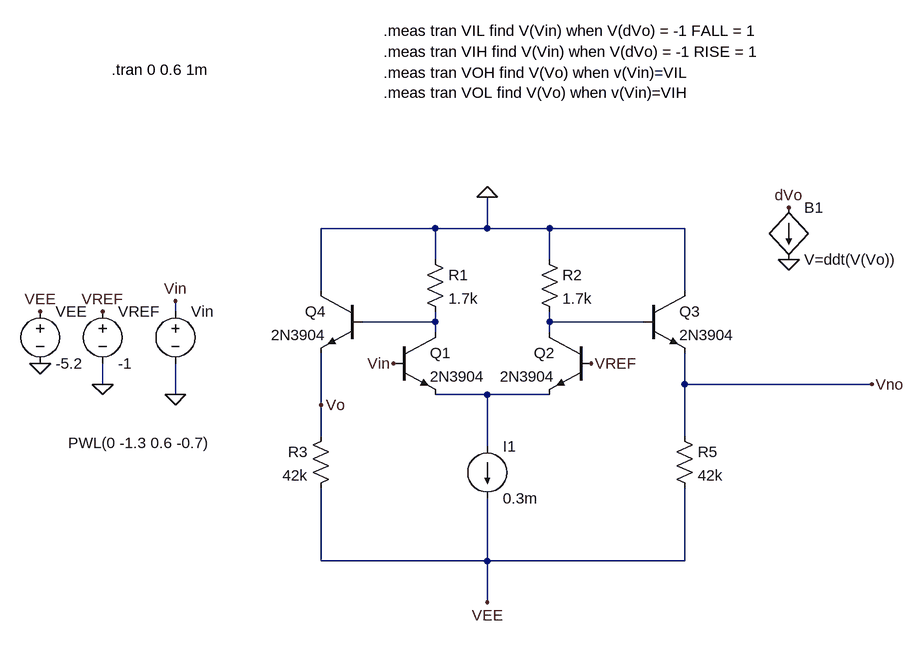
[diagram p0: schematic ECL_inverter_measure.asc]
ECL_inverter_measure.asc, the LTspice schematic file:
Version 4
SHEET 1 1408 680
WIRE 352 -160 176 -160
WIRE 432 -160 432 -208
WIRE 432 -160 352 -160
WIRE 528 -160 432 -160
WIRE 736 -160 528 -160
WIRE 352 -112 352 -160
WIRE 528 -112 528 -160
WIRE 176 -64 176 -160
WIRE 736 -64 736 -160
WIRE -48 -32 -48 -48
WIRE 352 -16 352 -32
WIRE 352 -16 240 -16
WIRE 528 -16 528 -32
WIRE 672 -16 528 -16
WIRE 352 0 352 -16
WIRE 528 0 528 -16
WIRE -160 80 -160 48
WIRE 736 80 736 32
WIRE 1024 80 736 80
WIRE -48 96 -48 48
WIRE 432 96 352 96
WIRE 528 96 432 96
WIRE 176 112 176 32
WIRE 176 160 176 112
WIRE 736 160 736 80
WIRE 432 176 432 96
WIRE 176 352 176 240
WIRE 432 352 432 256
WIRE 432 352 176 352
WIRE 736 352 736 240
WIRE 736 352 432 352
WIRE 432 416 432 352
FLAG -48 96 0
FLAG -160 80 0
FLAG -160 -32 VREF
FLAG 1024 80 Vno
FLAG 896 -112 0
FLAG 896 -192 dVo
FLAG -48 -48 Vin
FLAG 288 48 Vin
FLAG -256 -32 VEE
FLAG -256 48 0
FLAG 592 48 VREF
FLAG 432 -208 0
FLAG 432 416 VEE
FLAG 176 112 Vo
SYMBOL voltage -48 -48 R0
WINDOW 123 0 0 Left 0
WINDOW 39 0 0 Left 0
WINDOW 3 -165 218 Left 2
SYMATTR Value PWL(0 -1.3 0.6 -0.7)
SYMATTR InstName Vin
SYMBOL voltage -160 -48 R0
SYMATTR InstName VREF
SYMATTR Value -1
SYMBOL bi 896 -192 R0
SYMATTR InstName B1
SYMATTR Value V=ddt(V(Vo))
SYMBOL npn 288 0 R0
SYMATTR InstName Q1
SYMATTR Value 2N3904
SYMBOL npn 592 0 M0
SYMATTR InstName Q2
SYMATTR Value 2N3904
SYMBOL npn 672 -64 R0
SYMATTR InstName Q3
SYMATTR Value 2N3904
SYMBOL res 336 -128 R0
SYMATTR InstName R1
SYMATTR Value 1.7k
SYMBOL res 512 -128 R0
SYMATTR InstName R2
SYMATTR Value 1.7k
SYMBOL res 720 144 R0
SYMATTR InstName R5
SYMATTR Value 42k
SYMBOL current 432 176 R0
WINDOW 123 0 0 Left 0
WINDOW 39 0 0 Left 0
SYMATTR InstName I1
SYMATTR Value 0.3m
SYMBOL voltage -256 -48 R0
SYMATTR InstName VEE
SYMATTR Value -5.2
SYMBOL npn 240 -64 M0
SYMATTR InstName Q4
SYMATTR Value 2N3904
SYMBOL res 192 144 M0
SYMATTR InstName R3
SYMATTR Value 42k
TEXT 272 -464 Left 2 !.meas tran VIL find V(Vin) when V(dVo) = -1 FALL = 1
TEXT 272 -432 Left 2 !.meas tran VIH find V(Vin) when V(dVo) = -1 RISE = 1
TEXT 272 -400 Left 2 !.meas tran VOH find V(Vo) when v(Vin)=VIL\n.meas tran VOL find V(Vo) when v(Vin)=VIH
TEXT -146 -404 Left 2 !.tran 0 0.6 1m

The netlist it stands for:
* ECL_inverter_measure.asc
Vin Vin 0 PWL(0 -1.3 0.6 -0.7)
VREF VREF 0 -1
B1 dVo 0 V=ddt(V(Vo))
Q1 N001 Vin N003 0 2N3904
Q2 N002 VREF N003 0 2N3904
Q3 0 N002 Vno 0 2N3904
R1 0 N001 1.7k
R2 0 N002 1.7k
R5 Vno VEE 42k
I1 N003 VEE 0.3m
VEE VEE 0 -5.2
Q4 0 N001 Vo 0 2N3904
R3 Vo VEE 42k
.model NPN NPN
.model PNP PNP
.lib standard.bjt
.meas tran VIL find V(Vin) when V(dVo) = -1 FALL = 1
.meas tran VIH find V(Vin) when V(dVo) = -1 RISE = 1
.meas tran VOH find V(Vo) when v(Vin)=VIL
.meas tran VOL find V(Vo) when v(Vin)=VIH
.tran 0 0.6 1m
.backanno
.end